# EAGLE design IoT_pro_01 (EAGLE 7.1.0)
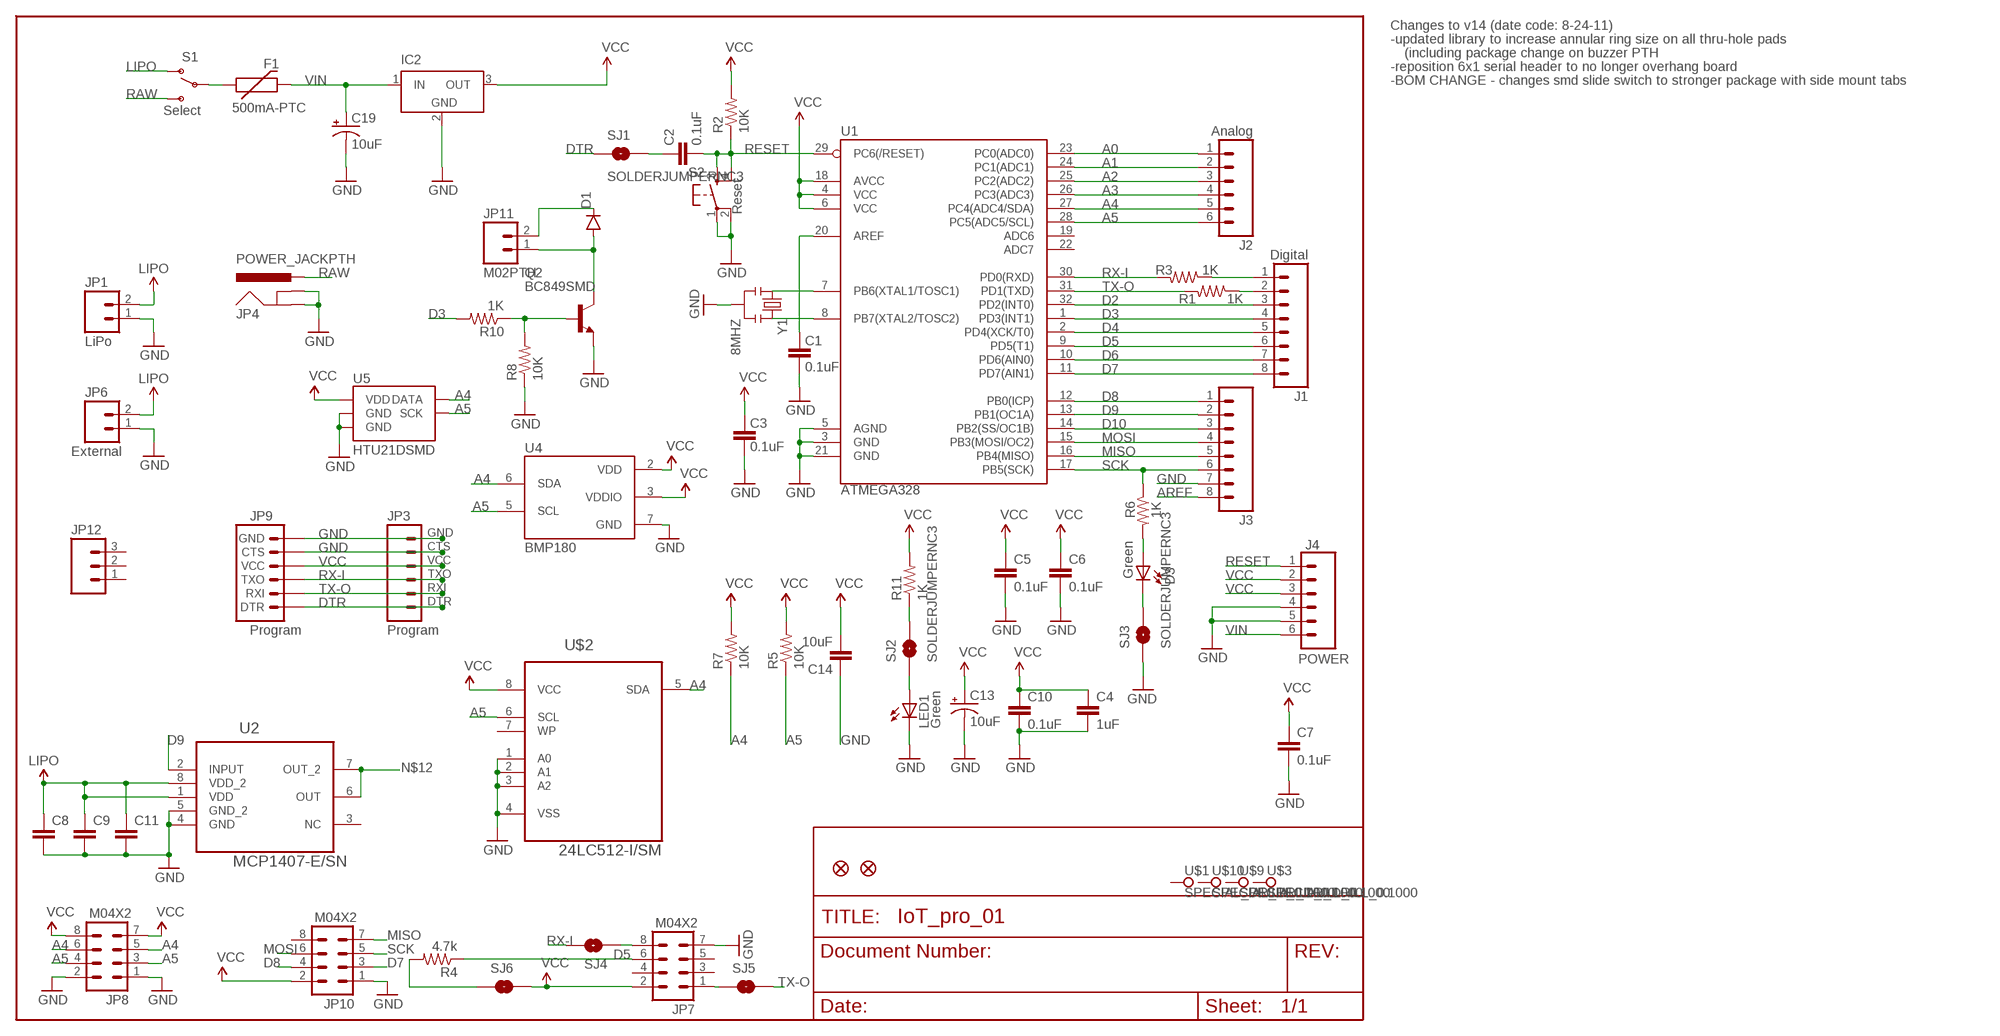
[diagram p0: schematic, sheet 1]

## Parts
C1  0.1uF  CAP0805  [0805]
C2  0.1uF  CAP0805  [0805]
C3  0.1uF  CAP0805  [0805]
C4  1uF  CAP0805  [0805]
C5  0.1uF  CAP0805  [0805]
C6  0.1uF  CAP0805  [0805]
C7  0.1uF  CAP0805  [0805]
C8  CAP0805  [0805]
C9  CAP0805  [0805]
C10  0.1uF  CAP0805  [0805]
C11  CAP0805  [0805]
C13  10uF  CAP_POL1206  [EIA3216]
C14  10uF  CAP0805  [0805]
C19  10uF  CAP_POL1206  [EIA3216]
D1  DIODESOD  [SOD-323]
D3  Green  LG_T679-E1F1-1  [PLCC2]
F1  500mA-PTC  PTCSMD  [PTC-1206]
IC2  LT1129CST5  [SOT223]
J1  Digital  M081X08  [1X08]
J2  Analog  M06SIP  [1X06]
J3  M081X08  [1X08]
J4  POWER  M06SIP  [1X06]
JP1  LiPo  M02POLAR  [MOLEX-1X2]
JP2  FIDUCIAL1X2.5  [FIDUCIAL-1X2.5]
JP3  Program  M06SIP  [1X06]
JP4  POWER_JACKPTH  [POWER_JACK_PTH]
JP5  FIDUCIAL1X2.5  [FIDUCIAL-1X2.5]
JP6  External  M02PTH  [1X02]
JP7  M04X2  [2X4]
JP8  M04X2  [2X4]
JP9  Program  ARDUINO_SERIAL_PROGRAMSMD  [1X06-SMD]
JP10  M04X2  [2X4]
JP11  M02PTH  [1X02]
JP12  M03PTH  [1X03]
LED1  Green  LG_T679-E1F1-1  [PLCC2]
Q2  BC849SMD  [SOT23-BEC]
R1  1K  RESISTOR0805-RES  [0805]
R2  10K  RESISTOR0805-RES  [0805]
R3  1K  RESISTOR0805-RES  [0805]
R4  4.7k  RESISTOR0805-RES  [0805]
R5  10K  RESISTOR0805-RES  [0805]
R6  1K  RESISTOR0805-RES  [0805]
R7  10K  RESISTOR0805-RES  [0805]
R8  10K  RESISTOR0805-RES  [0805]
R10  1K  RESISTOR0805-RES  [0805]
R11  1K  RESISTOR0805-RES  [0805]
S1  Select  SWITCH-SPDT-SMD-A  [SWITCH-SPST-SMD-A]
S2  Reset  TAC_SWITCHSMD  [TACTILE_SWITCH_SMD]
SJ1  SOLDERJUMPERNC3  SOLDERJUMPERNC2  [SJ_2S-NOTRACE]
SJ2  SOLDERJUMPERNC3  SOLDERJUMPERNC2  [SJ_2S-NOTRACE]
SJ3  SOLDERJUMPERNC3  SOLDERJUMPERNC2  [SJ_2S-NOTRACE]
SJ4  SOLDERJUMPERNC2  [SJ_2S-NOTRACE]
SJ5  SOLDERJUMPERNC2  [SJ_2S-NOTRACE]
SJ6  SOLDERJUMPERNC2  [SJ_2S-NOTRACE]
U1  ATMEGA328  ATMEGA168  [TQFP32-08]
U2  MCP1407-E/SN  [SOIC127P600X175-8N]
U4  BMP180  [BMP180]
U5  HTU21DSMD  [HTU21D]
U$1  SPECIAL_DRILL_0.1000  [PAD_0.1000]
U$2  24LC512-I/SM  [SOIC127P794X203-8N]
U$3  SPECIAL_DRILL_0.1000  [PAD_0.1000]
U$9  SPECIAL_DRILL_0.1000  [PAD_0.1000]
U$10  SPECIAL_DRILL_0.1000  [PAD_0.1000]
Y1  8MHZ  RESONATOR8MHZ  [RESONATOR-SMD]

## Nets
3.3V: C8.1 C9.1 C11.1 JP6.2 U2.1(VDD) U2.8(VDD_2) ; supply symbol labelled LIPO
A0: J2.1 U1.23(PC0(ADC0))
A1: J2.2 U1.24(PC1(ADC1))
A2: J2.3 U1.25(PC2(ADC2))
A3: J2.4 U1.26(PC3(ADC3))
A4: J2.5 JP8.5 JP8.6 R7.1 U1.27(PC4(ADC4/SDA)) U4.6(SDA) U5.DATA U$2.5(SDA)
A5: J2.6 JP8.3 JP8.4 R5.1 U1.28(PC5(ADC5/SCL)) U4.5(SCL) U5.SCK U$2.6(SCL)
AREF: C1.2 J3.8 U1.20(AREF)
D2: J1.3 U1.32(PD2(INT0))
D3: J1.4 R10.2 U1.1(PD3(INT1))
D4: J1.5 U1.2(PD4(XCK/T0))
D5: J1.6 JP7.6 R4.1 U1.9(PD5(T1))
D6: J1.7 U1.10(PD6(AIN0))
D7: J1.8 JP10.3 U1.11(PD7(AIN1))
D8: J3.1 JP10.4 U1.12(PB0(ICP))
D9: J3.2 U1.13(PB1(OC1A)) U2.2(INPUT)
D10: J3.3 U1.14(PB2(SS/OC1B))
DTR: JP3.DTR JP9.1(DTR) SJ1.1
GND [vcc]: C1.1 C3.1 C4.2 C5.2 C6.2 C7.2 C8.2 C9.2 C10.2 C11.2 C13.C(-) C14.1 C19.C(-) IC2.2(GND) J3.7 J4.4 J4.5 JP1.1 JP3.CTS JP3.GND JP4.GND JP4.GNDBREAK JP6.1 JP7.7 JP8.1 JP8.2 JP9.5(CTS) JP9.6(GND) JP10.1 LED1.C Q2.E R8.1 S2.1 S2.2 SJ3.1 U1.3(GND) U1.5(AGND) U1.21(GND) U2.4(GND) U2.5(GND_2) U4.7(GND) U5.7(GND) U5.GND U$2.1(A0) U$2.2(A1) U$2.3(A2) U$2.4(VSS) Y1.2
LIPO: JP1.2 S1.1(O)
MISO: J3.5 JP10.7 U1.16(PB4(MISO))
MOSI: J3.4 JP10.6 U1.15(PB3(MOSI/OC2))
N$1: C2.1 SJ1.2
N$3: U1.7(PB6(XTAL1/TOSC1)) Y1.1
N$4: U1.8(PB7(XTAL2/TOSC2)) Y1.3
N$6: LED1.A SJ2.1
N$7: D3.A R6.2
N$8: R11.1 SJ2.2
N$9: D3.C SJ3.2
N$10: JP7.8 SJ4.1
N$11: JP7.1 SJ5.1
N$12: D1.A JP11.1 Q2.C U2.6(OUT) U2.7(OUT_2)
N$13: D1.C JP11.2
N$14: Q2.B R8.2 R10.1
N$21: R4.2 SJ6.1
N$25: F1.1 S1.2(P)
RAW [vcc]: JP4.PWR S1.3(S)
RESET: C2.2 J4.1 R2.1 S2.3 S2.4 U1.29(PC6(/RESET))
RX-I: JP3.TXO JP9.3(TXO) R3.2 SJ4.2 U1.30(PD0(RXD))
RX-IP: J1.2 R1.1
SCK: J3.6 JP10.5 R6.1 U1.17(PB5(SCK))
TX-O: JP3.RXI JP9.2(RXI) R1.2 SJ5.2 U1.31(PD1(TXD))
TX-OP: J1.1 R3.1
VCC: C3.2 C4.1 C5.1 C6.1 C7.1 C10.1 C13.A(+) C14.2 IC2.3(OUT) J4.2 J4.3 JP3.VCC JP7.2 JP8.7 JP8.8 JP9.4(VCC) JP10.2 R2.2 R5.2 R7.2 R11.2 SJ6.2 U1.4(VCC) U1.6(VCC) U1.18(AVCC) U4.2(VDD) U4.3(VDDIO) U5.VDD U$2.8(VCC)
VIN [vcc]: C19.A(+) F1.2 IC2.1(IN) J4.6
Unconnected: JP7.3 JP7.4 JP7.5 JP10.8 JP12.1 JP12.2 JP12.3 U1.19(ADC6) U1.22(ADC7) U2.3(NC) U$1.1 U$2.7(WP) U$3.1 U$9.1 U$10.1

## Notes on the sheet
- Changes to v14 (date code: 8-24-11)
- -updated library to increase annular ring size on all thru-hole pads
- (including package change on buzzer PTH
- -reposition 6x1 serial header to no longer overhang board
- -BOM CHANGE - changes smd slide switch to stronger package with side mount tabs

## Power pins joined to a net without a drawn wire
GND: IC2.4(GND)

## Library data of the parts
C1-C7 C10 = SparkFun:CAP: Capacitor Standard 0603 ceramic capacitor, and 0.1" leaded capacitor.
C8 C9 C11 C14 = SparkFun-Capacitors:CAP: Capacitor Standard 0603 ceramic capacitor, and 0.1" leaded capacitor.
C13 C19 = SparkFun:CAP_POL: Capacitor Polarized These are standard SMD and PTH capacitors. Normally 10uF, 47uF, and 100uF in electrolytic and tantalum varieties. Always verify the external diameter of the through hole cap, it varies with capacity, voltage, and manufacturer. The EIA devices should be standard.
D1 = SparkFun-DiscreteSemi:DIODE: Diode These are standard reverse protection diodes and small signal diodes. SMA package can handle up to about 1A. SOD-323 can handle about 200mA. What the SOD-323 package when ordering, there are some mfgs out there that are 5-pin packages.; PROD_ID: DIO-09646
D3 LED1 = led:*_T679-?-1: LC TOPLED® Low Current LED Source: http://catalog.osram-os.com .. LG_LS_LY_T679_OBS.pdf; COLOR: green
F1 = SparkFun:PTC: Resettable Fuse PTC Resettable Fuse. Spark Fun Electronics SKU : COM-08357
IC2 = linear-technology:LT1129CST5: VOLTAGE REGULATOR with shutdown; MPN: LT1129CST-5#PBF; OC_FARNELL: 1663375; OC_NEWARK: 57M2069
J1 J3 = SparkFun:M08: Header 8 Standard 8-pin 0.1" header. Use with straight break away headers (SKU : PRT-00116), right angle break away headers (PRT-00553), swiss pins (PRT-00743), machine pins (PRT-00117), and female headers (PRT-00115).
J2 J4 = SparkFun:M06: Header 6 Standard 6-pin 0.1" header. Use with straight break away headers (SKU : PRT-00116), right angle break away headers (PRT-00553), swiss pins (PRT-00743), machine pins (PRT-00117), and female headers (PRT-00115). Molex polarized connector foot print use with SKU : PRT-08094 with associated ...
JP1 JP11 = SparkFun-Connectors:M02: Standard 2-pin 0.1" header. Use with - straight break away headers ( PRT-00116) - right angle break away headers (PRT-00553) - swiss pins (PRT-00743) - machine pins (PRT-00117) - female headers (PRT-00115) Molex polarized connector foot print use with: PRT-08233 with associated crimp pins and housings. 2.54_SCREWTERM for use with PRT-10571. 3.5mm Screw Terminal footprints for PRT-08084 5mm Screw Terminal footprints for use with PRT-08432
JP2 JP5 = abes:FIDUCIAL: Fiducial Alignment Points Various fiducial points for machine vision alignment.
JP3 = SparkFun-Connectors:M06: Header 6 Standard 6-pin 0.1" header. Use with straight break away headers (SKU : PRT-00116), right angle break away headers (PRT-00553), swiss pins (PRT-00743), machine pins (PRT-00117), and female headers (PRT-00115). Molex polarized connector foot print use with SKU : PRT-08094 with associated ...
JP4 = SparkFun:POWER_JACK: Power Jack This is the standard 5.5mm barrel jack for power. The PTH is the most common, proven, reliable, footprint. All others are experimental. The Slot footprint only works if the mill layer is transmitted to the PCB fab house so be warned. Spark Fun Electronics SKU : PRT-00119. Mating wall wart : TOL-00298 (and others)
JP6 = SparkFun:M02: Header 2 Standard 2-pin 0.1" header. Use with straight break away headers (SKU : PRT-00116), right angle break away headers (PRT-00553), swiss pins (PRT-00743), machine pins (PRT-00117), and female headers (PRT-00115). Molex polarized connector foot print use with SKU : PRT-08233 with associated crimp pins and housings.
JP7 JP8 JP10 = SparkFun-Connectors:M04X2: .1" header, two rows of four.
JP9 = SparkFun:ARDUINO_SERIAL_PROGRAM
JP12 = SparkFun-Connectors:M03: Header 3 Standard 3-pin 0.1" header. Use with straight break away headers (SKU : PRT-00116), right angle break away headers (PRT-00553), swiss pins (PRT-00743), machine pins (PRT-00117), and female headers (PRT-00115). Molex polarized connector foot print use with SKU : PRT-08232 with associated crimp pins and housings.
Q2 = transistor-npn:BC849*: NPN Transistor
R1-R8 R10 R11 = SparkFun:RESISTOR: Resistor Basic schematic elements and footprints for 0603, 1206, and PTH resistors.
S1 = SparkFun-Electromechanical:SWITCH-SPDT: SPDT Switch Simple slide switch, Spark Fun Electronics SKU : COM-00102 DPDT SMT slide switch, AYZ0202, SWCH-08179
S2 = SparkFun:TAC_SWITCH: Momentary Switch Button commonly used for reset or general input. Spark Fun Electronics SKU : COM-00097
SJ1-SJ6 = SparkFun:SOLDERJUMPER: Solder Jumper Standard SMD solder jumper. Used to automate production. Two varients : Normally Open and Normally Closed are the same, but have different paste layers. NC will have a large amount of paste and should jumper during reflow.
U1 = SparkFun:ATMEGA168
U2 = MCP1407:MCP1407-E/SN: IC, MOSFET DRIVER, LOW SIDE; MPN: MCP1407-E/SN; OC_FARNELL: 1332080; OC_NEWARK: 17M0582; PACKAGE: SOIC8; SUPPLIER: Microchip
U4 = SparkFun-Sensors:BMP180: BOSCH BMP180 DIGITAL BAROMETRIC PRESSURE SENSOR Web page: http://www.bosch-sensortec.com/en/homepage/products_3/environmental_sensors_1/bmp180_1/bmp180 Datasheet: http://ae-bst.resource.bosch.com/media/products/dokumente/bmp180/BST-BMP180-DS000-09.pdf The BMP180 is the function compatible successor of the BMP085, a new generation of high precision digital pressure sensors for consumer applications. The ultra-low power, low voltage electronics of the BMP180 is optimized for use in mobile phones, PDAs, GPS navigation devices and outdoor equipment. With a low altitude noise of merely 0.25m at fast conversion time, the BMP180 offers superior performance. The I2C interface allows for easy system integration with a microcontroller. The BMP180 is based on piezo-resistive technology for EMC robustness, high accuracy and linearity as well as long term stability. Key features: - Temperature measurement included - I2C interface - Fully calibrated - Pb-free, halogen-free and RoHS compliant, - MSL 1 Basic specs: Pressure range: 300 to 1100hPa (+9000m to -500m relating to sea level) Supply voltage: 1.8 to 3.6V (VDD), 1.62V to 3.6V (VDDIO) Package: LGA package with metal lid Small footprint: 3.6mm x 3.8mm Super-flat: 0.93mm height Low power: 5μA at 1 sample / sec. in standard mode Low noise: 0.06hPa (0.5m) in ultra low power mode, 0.02hPa (0.17m) advanced resolution mode Typical applications: - Enhancement of GPS navigation (dead-reckoning, slope detection, etc.) - In- and out-door navigation - Leisure and sports - Weather forecast - Vertical velocity indication (rise/sink speed)
U5 = SparkFun-Sensors:HTU21D
U$1 U$3 U$9 U$10 = special-drill:SPECIAL_DRILL_: Special drills
U$2 = 24LC512-I:24LC512-I/SM: 512K I2C Serial EEPROM; MPN: 24LC512-I/SM; OC_FARNELL: 9758038; OC_NEWARK: 62K0582; PACKAGE: SOIC-8; SUPPLIER: MICROCHIP
Y1 = SparkFun-FreqCtrl:RESONATOR: Resonator Small SMD resonator. Used, eg, on the Arduino Pro/ Pro Mini boards. 8MHz- XTAL-08895 16MHz- XTAL-08900; PROD_ID: XTAL-08895

## Net classes
0 default: width 0.203 mm
1 vcc: width 0.254 mm

## Board
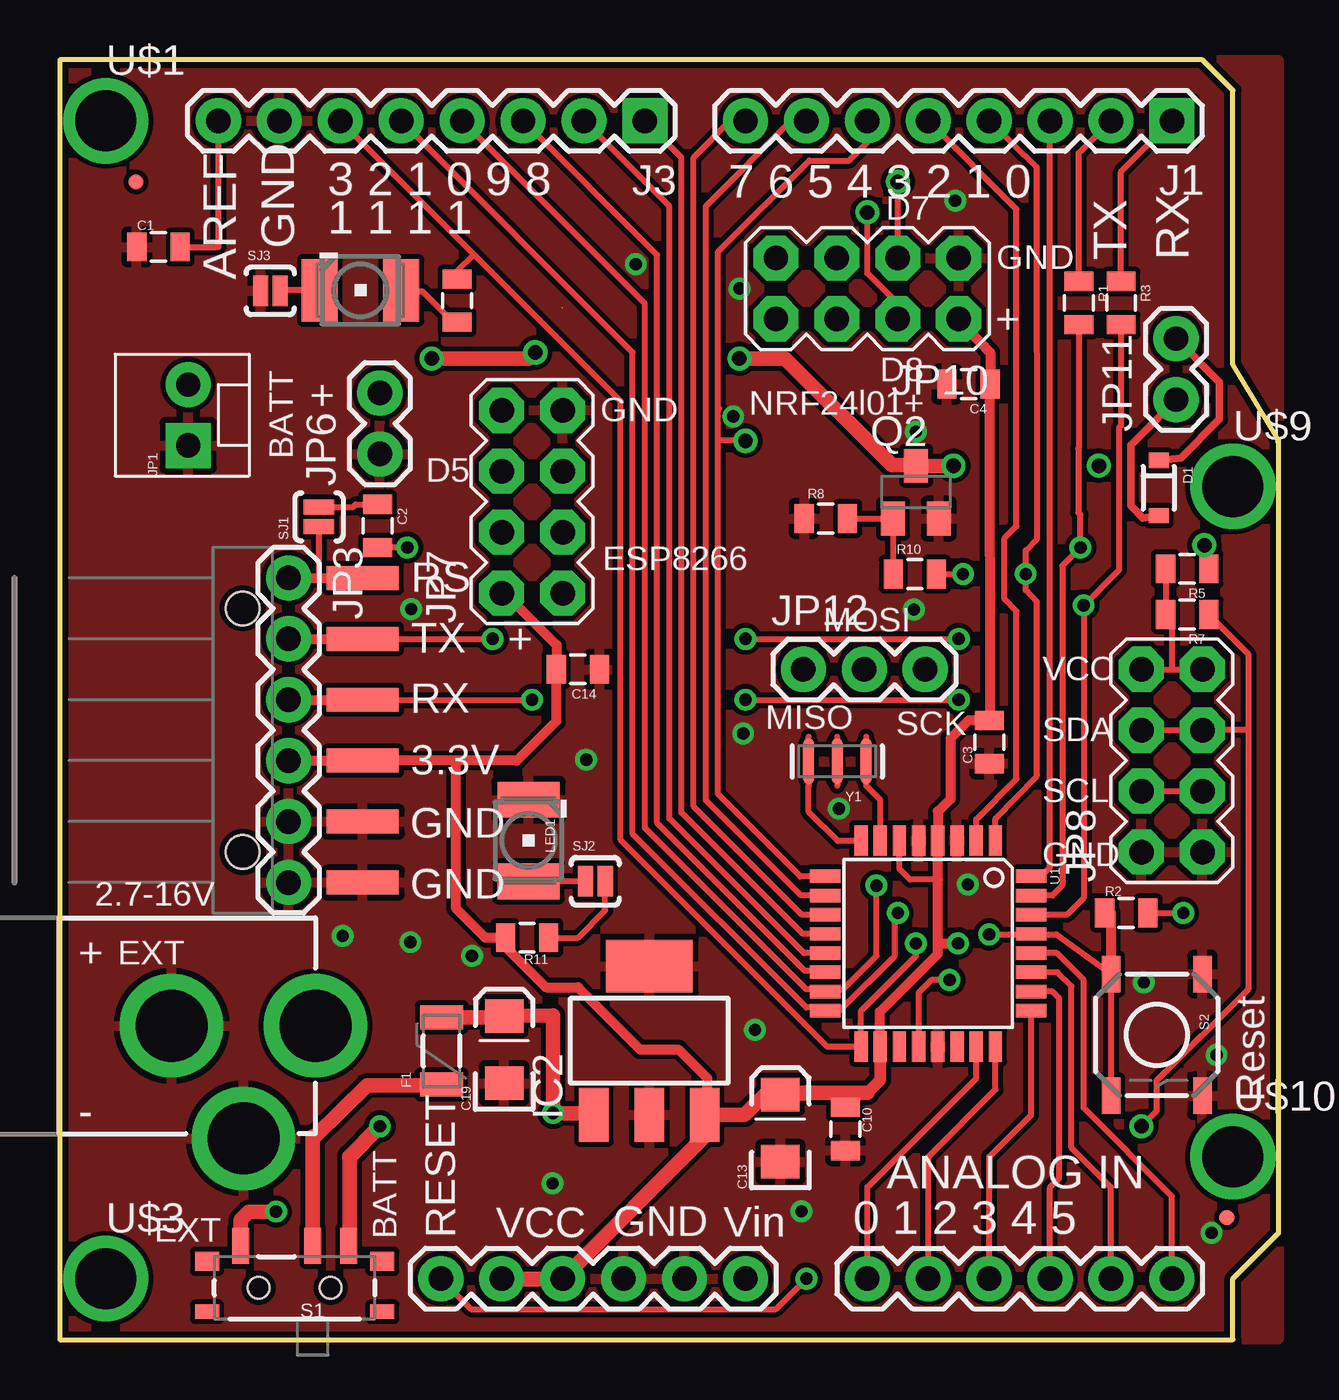
[diagram p1: board, top side]
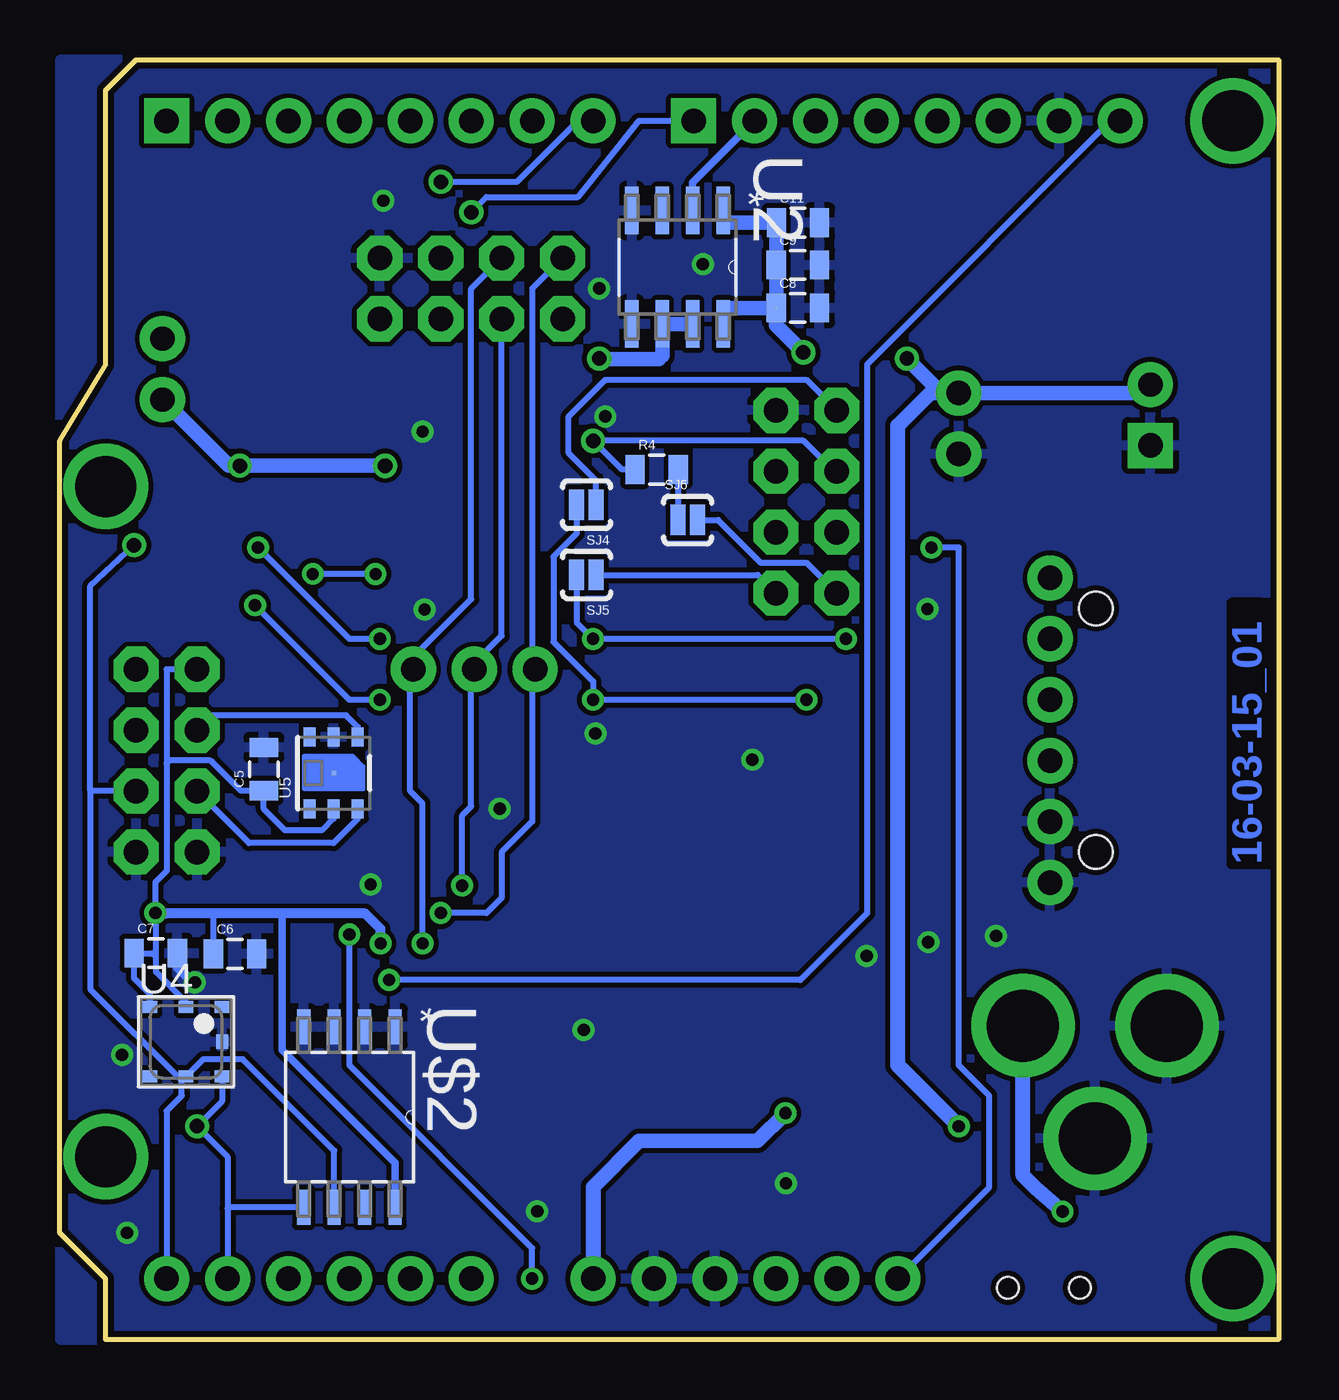
[diagram p2: board, bottom side, seen from below]

Size 50.8 x 53.34 mm. Coordinates in mm from the lower left corner, seen from the top.
Outline: 0,53.34 0,0 48.9,0 48.9,2.54 50.8,4.45 50.8,37.47 48.9,40.64 48.9,52.07 47.62,53.34 0,53.34
Copper layers (1*16): Top 0.035mm / dielectric 1.5mm / Bottom 0.035mm
Design rules "default *": minimum track width 10mil, minimum drill 24mil, track to track 8mil, track to pad 8mil, pad to pad 8mil, via to via 8mil, smd to smd 8mil, copper to edge 10mil, drill to drill 8mil, minimum pad ring 10mil, minimum via ring 8mil, stop-mask expansion 4mil, vias tented up to drill 0mil, thermal gap 10mil

### Footprints (pad centres in the part's own frame; a part is rotated, then mirrored left to right if it is on the bottom)
0805 = smd 0.8 x 1.2: 1 -0.9,0; 2 0.9,0
EIA3216 = smd 1.4 x 1.6: A 1.4,0; C -1.4,0
SOD-323 = smd 0.63 x 0.83: A 1.15,0; C -1.15,0
PLCC2 = smd 2.6 x 1.5: A 0,1.7; C 0,-1.7
PTC-1206 = smd 1 x 1.8: 1 -1.4,0; 2 1.4,0
SOT223 = smd 1.219 x 2.235: 1 -2.311,-3.099; 2 0,-3.099; 3 2.311,-3.099 | smd 3.6 x 2.2: 4 0,3.099
1X08 = drill 1.016 pad 1.88 square: 1 0,0 | drill 1.016 pad 1.88: 2 2.54,0; 3 5.08,0; 4 7.62,0; 5 10.16,0; 6 12.7,0; 7 15.24,0; 8 17.78,0
1X06 = drill 1.016 pad 1.88: 1 0,0; 2 2.54,0; 3 5.08,0; 4 7.62,0; 5 10.16,0; 6 12.7,0
MOLEX-1X2 = drill 1.016 pad 1.88 square: 1 0,0 | drill 1.016 pad 1.88: 2 2.54,0
FIDUCIAL-1X2.5 = smd 0.635 x 0.635: 1 0,0
1X06' = drill 1.016 pad 1.88: CTS 10.16,0; DTR 0,0; GND 12.7,0; RXI 2.54,0; TXO 5.08,0; VCC 7.62,0
POWER_JACK_PTH = drill 2.997 pad 4.318: GND 0,7.7; GNDBREAK 4.7,10.7; PWR 0,13.7
1X02 = drill 1.016 pad 1.88: 1 0,0; 2 2.54,0
2X4 = drill 1.016 pad 1.88 octagon: 1 -3.81,-1.27; 2 -3.81,1.27; 3 -1.27,-1.27; 4 -1.27,1.27; 5 1.27,-1.27; 6 1.27,1.27; 7 3.81,-1.27; 8 3.81,1.27
1X06-SMD = smd 1 x 3: 1 -6.35,5; 2 -3.81,5; 3 -1.27,5; 4 1.27,5; 5 3.81,5; 6 6.35,5 | hole 1.4: -5.08,0; 5.08,0
1X03 = drill 1.016 pad 1.88: 1 0,0; 2 2.54,0; 3 5.08,0
SOT23-BEC = smd 1 x 1.4: B -0.95,-1.1; C 0,1.1; E 0.95,-1.1
SWITCH-SPST-SMD-A = smd 0.7 x 1.5: 1 -2.25,-1.75; 2 -0.75,-1.75; 3 2.25,-1.75 | smd 1 x 0.6: GND1 -3.65,1; GND3 3.65,1 | smd 1 x 0.8: GND2 -3.65,-1.1; GND4 3.65,-1.1 | hole 0.9: -1.5,0; 1.5,0
TACTILE_SWITCH_SMD = smd 1.524 x 0.762: 1 -2.54,1.905; 2 2.54,1.905; 3 -2.54,-1.905; 4 2.54,-1.905
SJ_2S-NOTRACE = smd 0.635 x 1.27: 1 -0.401,0; 2 0.413,0
TQFP32-08 = smd 1.27 x 0.559: 1 -4.293,2.8; 2 -4.293,2; 3 -4.293,1.2; 4 -4.293,0.4; 5 -4.293,-0.4; 6 -4.293,-1.2; 7 -4.293,-2; 8 -4.293,-2.8; 17 4.293,-2.8; 18 4.293,-2; 19 4.293,-1.2; 20 4.293,-0.4; 21 4.293,0.4; 22 4.293,1.2; 23 4.293,2; 24 4.293,2.8 | smd 0.559 x 1.27: 9 -2.8,-4.293; 10 -2,-4.293; 11 -1.2,-4.293; 12 -0.4,-4.293; 13 0.4,-4.293; 14 1.2,-4.293; 15 2,-4.293; 16 2.8,-4.293; 25 2.8,4.293; 26 2,4.293; 27 1.2,4.293; 28 0.4,4.293; 29 -0.4,4.293; 30 -1.2,4.293; 31 -2,4.293; 32 -2.8,4.293
SOIC127P600X175-8N = smd 1.981 x 0.559: 1 -2.362,1.905; 2 -2.362,0.635; 3 -2.362,-0.635; 4 -2.362,-1.905; 5 2.362,-1.905; 6 2.362,-0.635; 7 2.362,0.635; 8 2.362,1.905
BMP180 = smd 0.6 x 0.5: 1 1.5,1.45; 2 0,1.45; 3 -1.5,1.45; 4 -1.5,-1.45; 5 0,-1.45; 6 1.5,-1.45 | smd 0.5 x 0.6: 7 1.5,0
HTU21D = smd 0.2 x 0.2: 7 0,0 | smd 0.8 x 0.5: DATA 1.5,-1; GND 1.5,0; NC@1 -1.5,1; NC@6 1.5,1; SCK -1.5,-1; VDD -1.5,0
PAD_0.1000 = drill 2.54 pad 2.54: 1 0,0
SOIC127P794X203-8N = smd 1.473 x 0.559: 1 -3.759,1.905; 2 -3.759,0.635; 3 -3.759,-0.635; 4 -3.759,-1.905; 5 3.759,-1.905; 6 3.759,-0.635; 7 3.759,0.635; 8 3.759,1.905
RESONATOR-SMD = smd 0.45 x 1.905: 1 -1.2,0; 2 0,0; 3 1.2,0

### Placement (x,y rotation side)
C1  4.11,45.54 0 top
C2  13.24,33.92 270 top
C3  38.75,24.91 90 top
C4  37.87,39.83 180 top
C5  42.3,23.78 90 bottom
C6  43.5,16.08 0 bottom
C7  46.8,16.11 0 bottom
C8  20.04,43 0 bottom
C9  20.04,44.79 0 bottom
C10  32.75,8.78 270 top
C11  20.03,46.56 0 bottom
C13  30.03,8.81 90 top
C14  21.59,27.94 180 top
C19  18.52,12.09 90 top
D1  45.8,35.5 270 top
D3  12.53,43.73 270 top
F1  15.91,12.03 90 top
IC2  24.57,12.46 0 top
J1  46.35,50.8 180 top
J2  33.66,2.54 0 top
J3  24.38,50.8 180 top
J4  15.88,2.54 0 top
JP1  5.34,37.27 90 top
JP2  48.64,5.08 90 top
JP3  Program  [1X06']  9.53,31.75 270 top
JP4  -3.05,13.08 270 top
JP5  3.17,48.26 0 top
JP6  13.34,36.92 90 top
JP7  19.68,34.92 90 top
JP8  46.35,24.13 90 top
JP9  7.62,25.4 270 top
JP10  33.66,43.81 180 top
JP11  46.53,39.18 90 top
JP12  30.99,27.94 0 top
LED1  19.54,20.8 180 top
Q2  35.68,35.32 0 top
R1  42.47,43.21 270 top
R2  44.45,17.78 0 top
R3  44.23,43.21 270 top
R4  25.93,36.27 0 bottom
R5  46.99,32.13 180 top
R6  16.56,43.31 270 top
R7  46.99,30.23 180 top
R8  31.93,34.23 0 top
R10  35.64,31.91 0 top
R11  19.47,16.75 180 top
S1  9.78,2.16 180 top
S2  45.72,12.7 270 top
SJ1  10.79,34.29 90 top
SJ2  22.31,19.1 0 top
SJ3  8.77,43.72 0 top
SJ4  28.85,34.8 180 bottom
SJ5  28.85,31.88 180 bottom
SJ6  24.64,34.16 0 bottom
U1  36.2,16.51 270 top
U2  25.06,44.7 270 bottom
U4  45.54,12.42 0 bottom
U5  39.38,23.61 90 bottom
U$1  1.91,50.8 0 top
U$2  38.73,9.27 270 bottom
U$3  1.91,2.54 0 top
U$9  48.9,35.56 0 top
U$10  48.9,7.62 0 top
Y1  32.4,24.11 180 top

### Tracks (layer width: path | path; a pad name or v marks a point on that pad's centre or on a via)
3.3V  (via drill 0.6)  (1 unrouted)
  Top 0.61: v15.49,40.89 19.56,40.89 v19.81,41.15
  Bottom 0.305: 23.08,46.56 23.15,46.48 | 23.08,43 23.15,42.93 | 20.93,43.03 20.83,42.93 20.83,44.68 C9.1
  Bottom 0.406: U2.1 23.15,46.48 | 23.15,42.93 U2.8
  Bottom 0.61: 23.08,46.56 C11.1 20.93,43.03 | 23.08,43 C8.1 20.95,42.86 20.95,42.29 v19.81,41.15 | JP6.2 14.06,39.46 v15.49,40.89
A0
  Top 0.254: U1.23 38.2,10.89 33.66,6.35 | J2.1 33.66,6.35 | 33.66,6.31 33.66,6.35
A1
  Top 0.254: U1.24 38.99,10.42 36.2,7.62 J2.2
A2
  Top 0.254: U1.25 40.49,9.37 38.73,7.62 38.73,2.79 38.86,2.67 J2.3
A3
  Top 0.254: U1.26 41.37,14.51 41.66,14.22 41.66,6.73 41.27,6.35 J2.4
A4  (via drill 0.6)
  Top 0.254: U1.27 41.59,15.31 42.16,14.73 42.16,8 43.81,6.35 J2.5 | R7.1 47.64,30.46 49.53,28.57 49.53,25.4 | 49.53,25.4 JP8.5 JP8.6 | 49.53,25.4 49.53,14.61 45.72,10.79 45.72,9.53 v45.09,8.89
  Bottom 0.254: 43.81,5.46 43.81,7.62 v45.09,8.89 44.04,9.93 U4.6 | 43.81,5.46 J2.5 | U5.DATA 38.38,25.54 38.87,26.02 44.46,26.02 JP8.6 | U$2.5 43.76,5.51 43.81,5.46
A5  (via drill 0.6)
  Top 0.254: U1.28 41.55,16.11 42.67,14.99 42.67,9.65 46.35,5.97 J2.6 | 47.62,32.38 R5.1 47.9,32.39 47.9,33.03 47.71,33.1 v47.71,33.12 | JP8.4 JP8.3
  Bottom 0.254: JP8.3 49.53,22.86 | 49.53,22.86 49.53,14.61 45.72,10.79 | J2.6 46.35,9.53 45.72,10.16 45.72,10.79 | 49.53,22.86 49.53,31.42 v47.71,33.12 | JP8.4 42.92,20.7 39.39,20.7 38.38,21.71 U5.SCK | 45.72,10.79 U4.5 44.82,11.68 43.18,11.68 39.37,7.87 U$2.6
AREF  (via drill 0.51)
  Top 0.254: U1.20 35.8,14.46 36.32,14.99 v37.08,14.99 | J3.8 6.6,45.55 6.53,45.54 C1.2
  Bottom 0.254: v37.08,14.99 19.94,14.99 17.14,17.78 17.14,40.66 6.99,50.82 J3.8
D2
  Top 0.254: U1.32 40.89,19.31 40.89,19.3 41.27,19.68 J1.3
D3  (via drill 0.5)
  Top 0.254: U1.1 38.99,21.72 40.72,23.5 40.72,23.53 40.73,30.73 40.26,31.24 v40.26,31.92 40.26,32.89 40.73,33.39 40.72,48.88 J1.4 | R10.2 v37.65,31.91
  Bottom 0.254: v40.26,31.92 39.02,31.91 v37.65,31.91
D4
  Top 0.254: U1.2 38.2,21.68 39.88,23.37 39.88,30.35 39.37,30.86 39.37,33.4 39.88,33.91 39.88,47.12 J1.5
D5  (via drill 0.6)
  Top 0.254: U1.9 32,19.3 | U1.9 | U1.9 30.86,19.3 27.43,22.73 27.43,37.47 | 27.43,37.47 27.43,38.86 | 27.43,38.86 27.43,45.34 31.24,49.15 32.89,49.15 33.66,49.91 J1.6 | 27.43,38.86 27.48,38.81 | v28.57,37.47 27.43,37.47
  Bottom 0.254: JP7.6 18.54,36.2 19.81,37.47 v28.57,37.47 27.38,36.27 R4.1
D6
  Top 0.254: U1.10 31.78,18.51 31.75,18.54 30.86,18.54 26.92,22.48 26.92,47.24 30.48,50.8 J1.7
D7  (via drill 0.6)
  Top 0.254: U1.11 30.93,17.71 26.42,22.23 26.42,49.28 27.94,50.8 J1.8 | JP10.3 v34.92,48.26
  Bottom 0.254: J1.8 29.21,50.8 31.75,48.26 v34.92,48.26
D8  (via drill 0.6)
  Top 0.254: U1.12 30.97,16.91 25.91,21.97 25.91,49.28 J3.1 | v33.66,46.99 33.66,44.45 34.92,43.18 JP10.4
  Bottom 0.254: J3.1 26.67,50.8 29.21,47.62 33.02,47.62 v33.66,46.99
D9
  Top 0.254: U1.13 31.01,16.11 25.4,21.72 25.4,47.24 J3.2
  Bottom 0.305: U2.2 24.42,48.22 J3.2
D10
  Top 0.254: J3.3 24.89,45.21 24.89,21.53 31.05,15.37 31.88,15.37 31.88,15.34 U1.14
DTR
  Top 0.254: JP9.1 10.71,31.8 10.79,31.88 SJ1.1
  Top 0.406: JP3.DTR JP9.1
GND  (via drill 0.51)
  Bottom 0.406: v45.18,14.89 45.27,14.89 45.91,15.54 C7.2
  other vias: 32.47,22.13 21.94,24.17 35.69,37.85 48.01,4.45 37.85,18.97 20.53,6.51 28.48,25.26 30.9,5.34 28.97,12.9 37.32,47.48 48.21,11.87 11.78,16.83 14.61,16.56 17.17,15.99 14.64,30.45 35.6,30.43 28.32,43.81 28.07,38.48 24,44.83
  pour Top: 0,53.34 50.8,53.34 50.8,0 0,0
  pour Bottom: 0,53.34 50.8,53.34 50.8,0 0,0
LIPO  (via drill 0.51)
  Top 0.61: 12.06,7.62 12.08,7.33 12.06,7.33 12.06,4.45 12.03,4.45 S1.1
  Top 0.635: 12.06,7.62 v13.34,8.89
  Bottom 0.61: JP1.2 5.39,39.81 6.13,39.45 14.52,39.45 15.88,38.1
  Bottom 0.635: 15.88,38.1 15.88,11.43 v13.34,8.89
MISO  (via drill 0.51)
  Top 0.254: J3.5 23.88,41.15 23.88,21.08 31.11,13.84 32,13.84 31.9,13.74 U1.16 | U1.16 | U1.16 32,13.71 32,13.72 32.51,13.72 34.8,16 34.8,17.65 v34.92,17.78
  Bottom 0.254: JP10.7 31.11,43.81 31.11,21.59 32.38,20.32 32.38,18.41 33.02,17.78 v34.92,17.78
MOSI  (via drill 0.51)
  Top 0.254: J3.4 24.38,43.18 24.38,21.34 31.11,14.61 31.88,14.61 31.9,14.58 U1.15 | 32,14.48 31.93,14.48 U1.15 | v34.04,18.92 34.04,16 32.64,14.61 32.13,14.61 32,14.48 | 32,14.48 31.97,14.51 U1.15
  Bottom 0.254: v34.04,18.92 34.04,21.84 33.66,22.23 33.66,28.07 32.38,29.34 JP10.6
N$1
  Top 0.254: C2.1 12.33,34.81 12.23,34.71 SJ1.2
N$3
  Top 0.254: U1.7 34.2,22.5 33.6,23.09
N$4
  Top 0.254: U1.8 33.37,20.78 32.43,20.78 31.21,22 31.21,23.09 31.2,23.09
N$5
  pour Bottom: 34.8,51.31 35.05,51.31 35.05,50.29 34.8,50.29
N$6
  Top 0.254: SJ2.1 LED1.A
N$7
  Top 0.254: R6.2 16.39,42.41 15.11,43.69 14.27,43.69 D3.A
N$8
  Top 0.254: SJ2.2 22.73,17.89 21.59,16.75 R11.1
N$9
  Top 0.254: D3.C 9.2,43.73 SJ3.2
N$10
  Bottom 0.254: SJ4.1 28.45,35.81 29.59,36.96 29.59,38.48 28.07,40.01 19.68,40.01 JP7.8
N$11
  Bottom 0.254: SJ5.1 21.72,31.88 JP7.1
N$12  (via drill 0.6)
  Top 0.254: Q2.C 35.72,36.42 | v43.31,36.43
  Top 0.305: D1.A 45.15,34.25 44.64,34.76 44.64,37.29 JP11.1 46.52,39.19
  Top 0.406: 35.58,36.45 Q2.C
  Top 0.61: 35.72,36.42 v37.24,36.42 | 35.58,36.45 34.67,36.45 30.23,40.89 v28.32,40.89
  Bottom 0.254: v37.24,36.42 37.24,36.43
  Bottom 0.406: 44.79,37.41 JP11.1 | U2.7 U2.6 | 25.59,42.34 25.67,42.42 | 25.67,41.01 25.82,40.86
  Bottom 0.61: 37.24,36.43 v43.31,36.43 | v43.31,36.43 43.78,36.43 JP11.1 | U2.7 25.59,42.34 | 25.67,42.42 25.67,41.01 | 25.82,40.86 28.23,40.86 v28.32,40.89
N$13
  Top 0.305: D1.C 46.72,36.75 48.34,38.37 48.34,39.91 JP11.2
N$14
  Top 0.254: R8.2 Q2.B R10.1
N$15  (via drill 0.6)
  other vias: 37.25,36.43
N$16
  pour Top: 34.8,51.31 35.05,51.31 35.05,50.29 34.8,50.29
N$17
  pour Top: 42.42,3.05 42.67,3.05 42.67,2.03 42.42,2.03
N$18
  pour Bottom: 42.42,3.05 42.67,3.05 42.67,2.03 42.42,2.03
N$21
  Bottom 0.254: R4.2 25.03,34.18 SJ6.1
N$22
  pour Bottom: 32.13,28.32 32.38,28.32 32.38,27.56 32.13,27.56
N$23
  pour Bottom: 34.67,28.32 34.92,28.32 34.92,27.56 34.67,27.56
N$24
  pour Top: 18.03,50.16 18.29,50.16 18.29,50.04 18.41,50.04 18.41,49.91 18.54,49.91 18.54,49.78 18.67,49.78 18.67,49.66 18.67,49.53 18.41,49.53 18.41,49.78 18.29,49.78 18.16,49.78 18.16,49.91 18.16,50.04 18.03,50.04
N$25
  Top 0.61: F1.1 15.88,10.6 12.8,10.59 10.64,8.47 10.53,8.47 S1.2
N$26
  pour Top: 17.91,51.18 18.16,51.18 18.16,50.42 17.91,50.42
N$27
  pour Top: 18.16,50.16 18.41,50.16 18.41,50.04 18.54,50.04 18.54,49.91 18.67,49.91 18.67,49.78 18.67,49.66 18.29,49.66 18.29,49.78 18.16,49.78 18.16,49.91 18.03,49.91 18.03,50.04 17.91,50.04 17.91,50.16
RAW  (via drill 0.51)
  Top 0.61: JP4.PWR 10.65,13.11 9.45,14.31 10.65,13.11 10.63,13.11 10.63,11.26 | S1.3 7.53,4.99 7.87,5.33 v9,5.33
  Bottom 0.61: v9,5.33 10.13,6.33 10.14,6.33 10.65,6.84
  Bottom 0.635: 10.65,6.84 JP4.PWR
RESET  (via drill 0.51)
  Top 0.254: J4.1 17.14,1.27 29.84,1.27 v31.11,2.54 | v38.73,16.89 40.39,16.89 40.41,16.91 U1.29 40.62,16.91 40.64,16.89 41.53,16.89 S2.3 S2.4 | C2.2 14.08,33.01 v14.48,33.02
  Top 0.406: R2.1 43.81,17.78 S2.3
  Bottom 0.254: v38.73,16.89 38.73,11.43 31.11,3.81 v31.11,2.54 | J4.1 12.06,6.35 12.06,10.16 13.34,11.43 13.34,33.02 v14.48,33.02
RX-I  (via drill 0.51)
  Top 0.254: U1.30 41.97,17.71 42.67,18.41 v42.67,30.61 44.15,32.08 44.15,38.01 44.23,38.09 R3.2 | JP9.3 v19.68,26.67 | v28.57,26.67 v37.47,26.67 | 9.52,26.66 JP3.TXO
  Top 0.406: JP3.TXO JP9.3
  Bottom 0.254: v42.67,30.61 38.73,26.67 v37.47,26.67 | v19.68,26.67 v28.57,26.67 28.57,27.43 30.23,29.08 30.23,32.64 29.26,33.6 SJ4.2
RX-IP
  Top 0.254: R1.1 42.47,49.45 J1.2
SCK  (via drill 0.51)
  Top 0.254: 17.25,45.23 23.37,39.12 23.37,20.83 31.98,12.22 U1.17 33.4,13.71 35.69,16 v35.69,16.51 | 17.25,45.23 J3.6 | R6.1 16.56,44.53 17.25,45.23
  Bottom 0.254: JP10.5 33.66,43.81 33.66,30.86 36.2,28.32 36.2,22.86 35.69,22.35 v35.69,16.51
TX-O  (via drill 0.51)
  Top 0.254: U1.31 41.37,18.51 41.78,18.92 41.78,32.26 v42.55,33.02 42.54,34.38 42.45,34.48 42.45,37.14 42.47,37.17 R1.2 | JP9.2 v18.03,29.21 | v28.57,29.21 v37.47,29.21 | JP3.RXI
  Top 0.406: JP3.RXI JP9.2
  Bottom 0.254: v42.55,33.02 38.73,29.21 v37.47,29.21 | v18.03,29.21 v28.57,29.21 29.26,29.9 SJ5.2
TX-OP
  Top 0.254: R3.1 44.23,48.68 J1.1
VCC  (via drill 0.51)
  Top 0.254: 33.66,10.29 C10.1 | C13.A 30.56,10.19 31.11,10.16 | U1.18 34.19,12.22 | 36.6,20.9 U1.4 | U1.6 34.99,19.61 35.43,19.18 36.6,19.18 | R2.2 v46.82,17.78 | JP8.8 46.35,27.94 | 46.35,27.94 JP8.7 | R5.2 R7.2 46.35,30.48 46.35,27.94 | 20.95,27.95 C14.2 20.7,27.95 | 20.69,25.77 20.68,25.77 | 16.52,24.04 16.43,24.13 | R11.2 18.57,16.37 | 26.97,9.45 IC2.3
  Top 0.406: 34.19,12.22 34.18,13.66 36.59,16.07 36.6,16.51 | 36.6,16.51 36.6,19.18 U1.4 | 36.6,16.51 v37.44,16.51 | JP3.VCC JP9.4 16.43,24.13 19.05,24.13 20.68,25.77 | C14.2 20.69,25.77 | JP10.2 37.47,42.52 38.78,41.15 38.78,40.33 C4.1 38.73,39.37 38.76,25.91 C3.2 37.87,25.8 37.13,25.06 37.13,22.52 36.6,22.02 36.6,20.83 U1.4 | 16.52,24.04 16.52,17.97 17.73,16.75 R11.2 | 26.97,9.45 26.97,10.9 25.78,12.1 24.18,12.1 21.6,14.68 20.26,14.68 18.57,16.37 | JP7.2 18.54,31.11 20.7,28.96 20.7,27.95
  Top 0.508: U1.18 34.2,10.83 33.66,10.29
  Top 0.61: 31.24,10.29 33.66,10.29 | 31.28,10.27 C13.A 29.83,10.41 29.59,10.41 28.54,9.36 IC2.3 26.85,8.45 J4.3 | 30.37,10 30.56,10.19
  Top 0.635: 31.11,10.29 C13.A 31.24,10.29 | J4.2 J4.3
  Bottom 0.254: 46.38,17.75 v46.82,17.78 | JP8.8 46.35,27.94 46.36,24.02 | 46.36,24.02 46.36,19.53 46.82,19.06 v46.82,17.78 | 46.36,24.02 46.24,24.13 44.52,24.13 44.5,24.1 44.47,24.1 43.25,22.88 C5.1 42.31,22.11 41.42,21.22 39.88,21.22 39.38,21.72 U5.VDD | U4.2 45.54,14.06 46.8,15.32 46.8,15.96 | 46.8,15.96 46.8,17.76 v46.82,17.78 | 46.8,15.96 46.95,16.11 C7.1 47.71,16.09 47.71,15.06 47.04,14.39 U4.3 | C6.1 44.4,17.68 44.48,17.75 | SJ6.2 23.37,34.16 21.59,32.38 19.68,32.38 JP7.2
  Bottom 0.305: U$2.8 36.83,7.37 41.53,12.06 41.53,17.75
  Bottom 0.406: v37.44,16.51 37.44,17.12 38.08,17.75 41.53,17.75 44.48,17.75 46.38,17.75
VIN  (via drill 0.51)
  Top 0.61: F1.2 18.62,13.43 C19.A 20.56,13.51 20.56,13.43 v20.56,9.44 22.35,9.44 IC2.1
  Bottom 0.61: 28.57,6.35 26.65,8.27 21.73,8.27 v20.56,9.44
  Bottom 0.635: 28.57,6.35 J4.6

### Text on the board
Bottom: 16-03-15_01
tPlace: 3 2 1 0 9 8 | 7 6 5 4 3 2 1 0 | D7 | 1 1 1 1 | GND | GND | TX | RX | AREF | + | D8 | + | NRF24l01+ | GND | BATT | - | D5 | ESP8266 | RS | MOSI | TX | + | VCC | RX | MISO | SCK | SDA | 3.3V | SCL | GND | GND | 2.7-16V | GND | EXT | + | Reset | - | Vin | ANALOG IN | EXT | BATT | RESET | VCC | GND | 0 1 2 3 4 5
tValues: DNP | DNP | JST-Right Angle | DNP | Production: DNP | Production: DNP | Proto: 2x3 male header up | DNP | DNP | DNP